# EAGLE design tri-led-blinker (EAGLE 7.3.0)
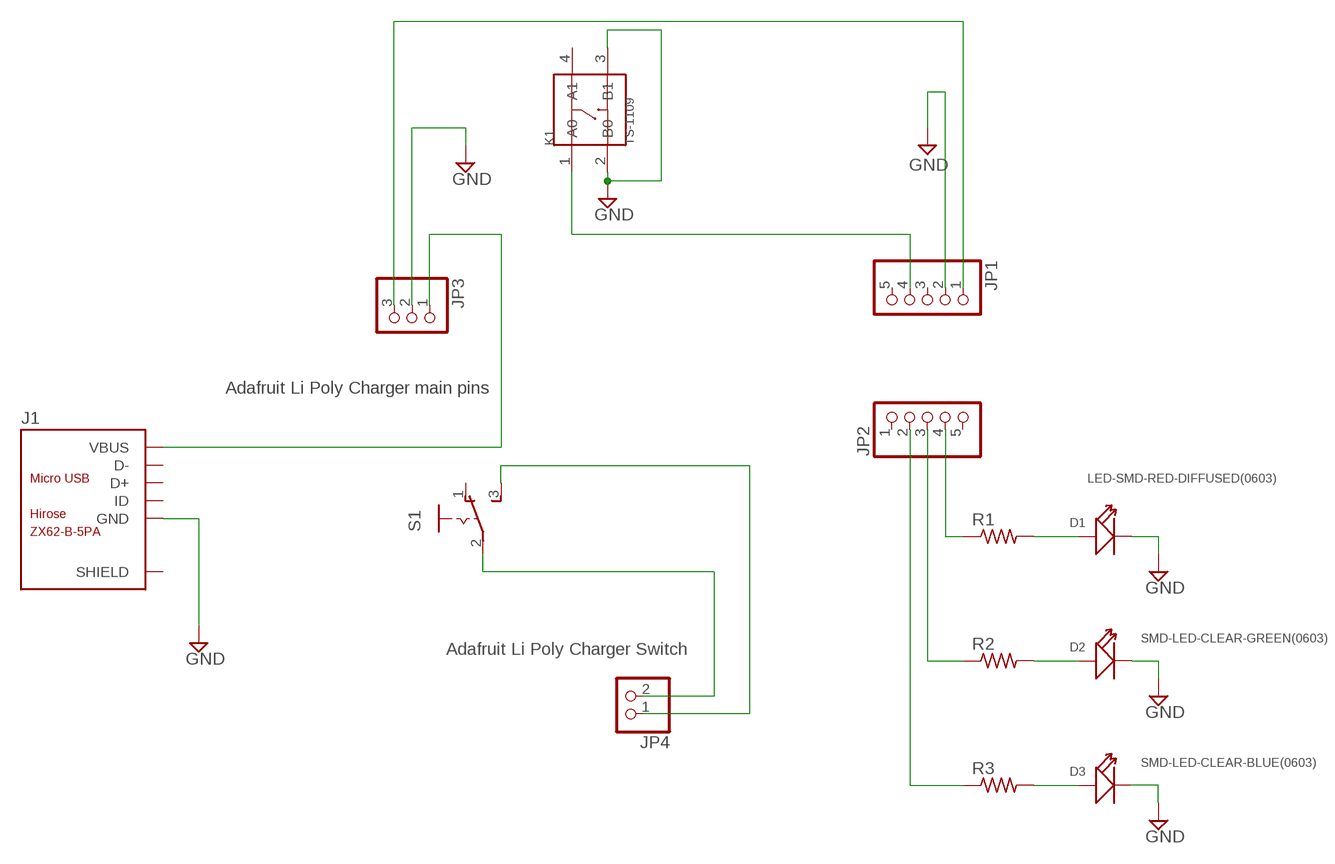
[diagram p0: schematic, sheet 1]

## Parts
D1  LED-SMD-RED-DIFFUSED(0603)  [LED-0603]
D2  SMD-LED-CLEAR-GREEN(0603)  [LED-0603]
D3  SMD-LED-CLEAR-BLUE(0603)  [LED-0603]
J1  MICRO-USB-SMD(ZX62-B-5PA)  [MICRO-USB5+6P-SMD-0.65-AB]
JP1  PINHD-1X5  [1X05]
JP2  PINHD-1X5  [1X05]
JP3  Adafruit Li Poly Charger main pins  PINHD-1X3  [1X03]
JP4  Adafruit Li Poly Charger Switch  PINHD-1X2  [1X02]
K1  TS-1109  DIP-BUTTON-4P  [SW4-6.0X6.0X5.0MM]
R1  R-US_0207/7  [0207/7]
R2  R-US_0207/7  [0207/7]
R3  R-US_0207/7  [0207/7]
S1  M251  [M251]

## Nets
GND: D1.- D2.- D3.- J1.5(GND) JP1.2 JP3.2 K1.2(B0) K1.3(B1)
N$1: D1.+ R1.2
N$2: JP4.2 S1.2(P)
N$3: JP4.1 S1.3(S)
N$4: D2.+ R2.2
N$5: JP1.4 K1.1(A0)
N$6: JP2.2 R3.1
N$7: D3.+ R3.2
N$8: JP2.4 R1.1
N$9: JP1.1 JP3.3
N$10: JP2.3 R2.1
VBUS: J1.1(VBUS) JP3.1
Unconnected: J1.2(D-) J1.3(D+) J1.4(ID) J1.P1(SHIELD) J1.P2(SHIELD) J1.P3(SHIELD) J1.P4(SHIELD) J1.P5(SHIELD) J1.P6(SHIELD) JP1.3 JP1.5 JP2.1 JP2.5 K1.4(A1) S1.1(O)

## Library data of the parts
D1 = Seeed-OPL-Diode:LED-SMD-RED-DIFFUSED(0603): 304090042; MPN: 19-217-R6C-AL1M2VY-3T
D2 = Seeed-OPL-Diode:SMD-LED-CLEAR-GREEN(0603): 304090043; MPN: 19-217-G7C-AN1P2-3T
D3 = Seeed-OPL-Diode:SMD-LED-CLEAR-BLUE(0603): 304090045; MPN: 19-217-BHC-ZL1M2RY-3T
J1 = Seeed-OPL-Connector:MICRO-USB-SMD(ZX62-B-5PA): 320010005
JP1 JP2 = pinhead:PINHD-1X5: PIN HEADER
JP3 = pinhead:PINHD-1X3: PIN HEADER
JP4 = pinhead:PINHD-1X2: PIN HEADER
K1 = Seeed-OPL-Button:DIP-BUTTON-4P: 311020024
R1-R3 = resistor:R-US_: RESISTOR, American symbol
S1 = switch:M251: SLIDING SWITCH Mors, distributor Buerklin, 11G702

## Board
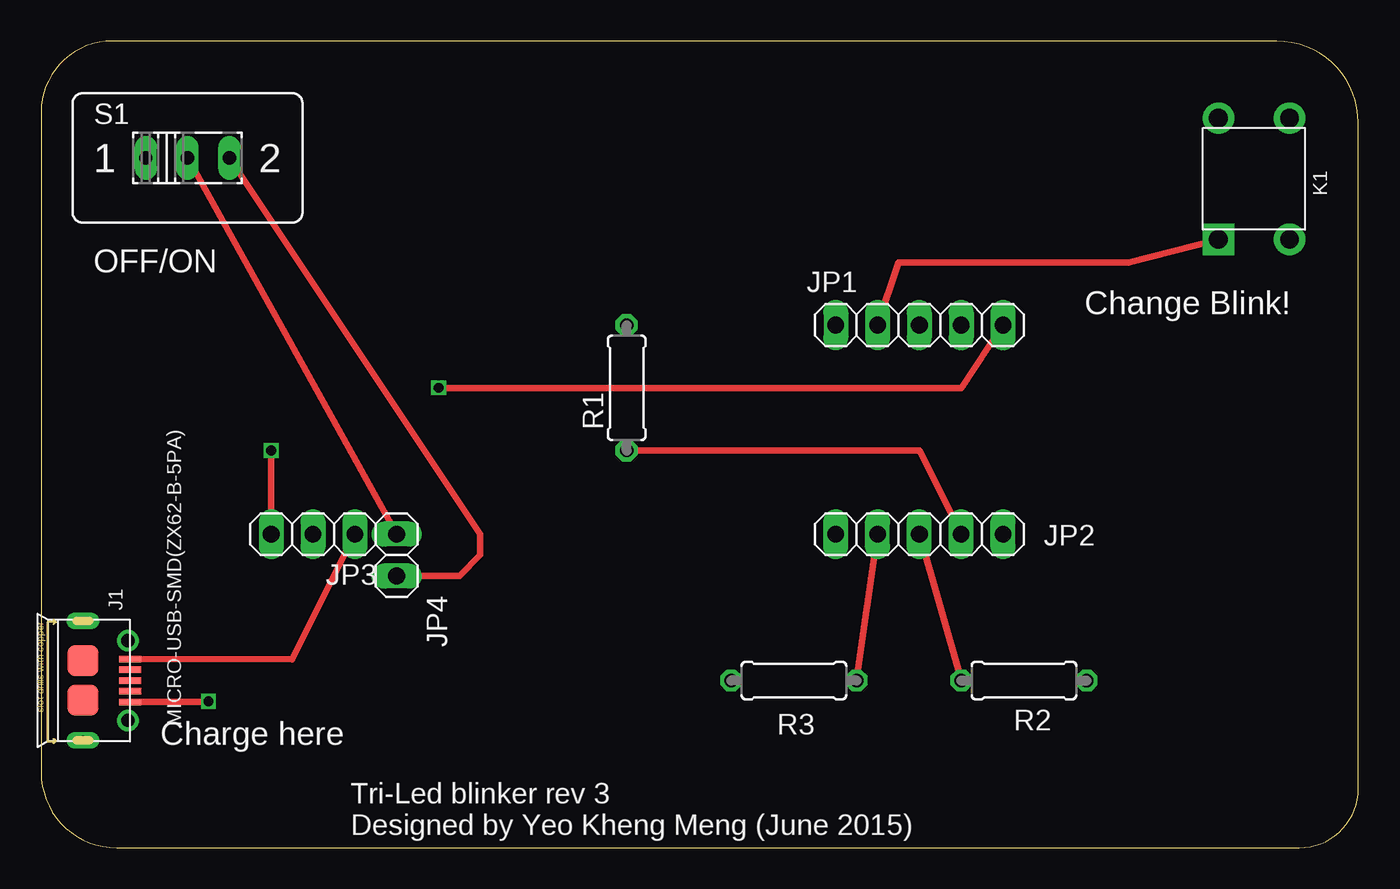
[diagram p1: board, top side]
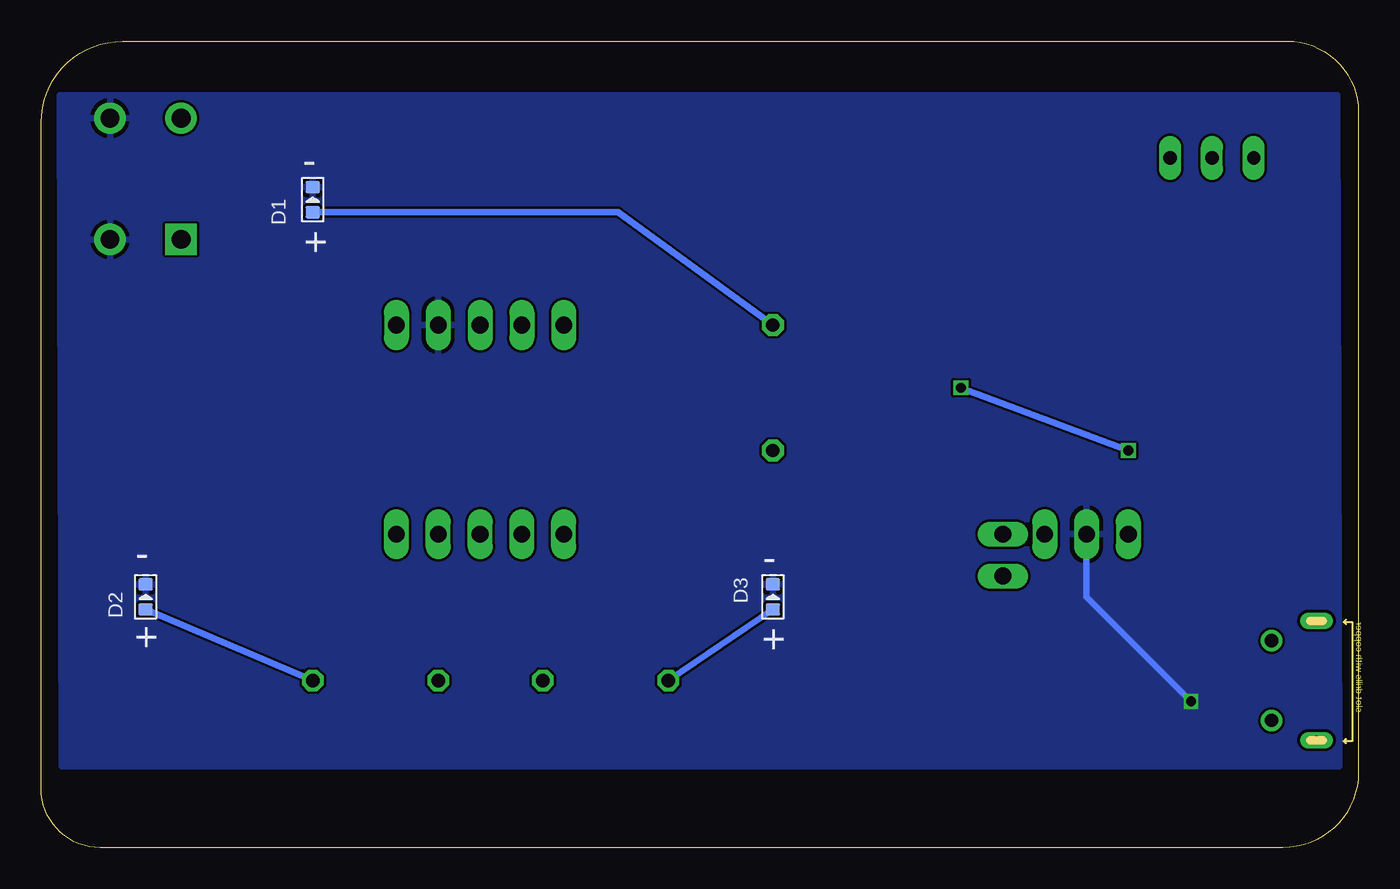
[diagram p2: board, bottom side, seen from below]

Size 80 x 49 mm. Coordinates in mm from the lower left corner, seen from the top.
Outline: 80,3.58 80,44.06 arc90 75.06,49 4.31,49 arc90 0,44.69 0,4.58 arc90 4.58,0 76.42,0 arc90 80,3.58
Copper layers (1*16): Top 0.035mm / dielectric 1.5mm / Bottom 0.035mm
Design rules "SeeedStudio_2layer_DRU_no_angle_20140221": minimum track width 6mil, minimum drill 12mil, track to track 6mil, track to pad 6mil, pad to pad 6mil, via to via 6mil, smd to smd 0mil, copper to edge 10mil, drill to drill 10mil, minimum pad ring 10mil, minimum via ring 6mil, stop-mask expansion 2mil, vias tented up to drill 100mil, thermal gap 10mil

### Footprints (pad centres in the part's own frame; a part is rotated, then mirrored left to right if it is on the bottom)
LED-0603 = smd 0.762 x 0.889: + -0.762,0; - 0.762,0
MICRO-USB5+6P-SMD-0.65-AB = smd 0.4 x 1.35: 1 -1.3,2.875; 2 -0.65,2.875; 3 0,2.875; 4 0.65,2.875; 5 1.3,2.875 | smd 1.9 x 1.9: P1 -1.2,0; P2 1.2,0 | drill 0.508 pad 1.016 long: P3 -3.625,0; P4 3.625,0 | drill 0.8: P5 -2.425,2.73; P6 2.425,2.73
1X05 = drill 1.016 long: 1 -5.08,0; 2 -2.54,0; 3 0,0; 4 2.54,0; 5 5.08,0
1X03 = drill 1.016 long: 1 -2.54,0; 2 0,0; 3 2.54,0
1X02 = drill 1.016 long: 1 -1.27,0; 2 1.27,0
SW4-6.0X6.0X5.0MM = drill 1.143 pad 1.905 square: 1 -3.683,2.159 | drill 1.143 pad 1.905: 2 -3.683,-2.159; 3 3.683,-2.159; 4 3.683,2.159
0207/7 = drill 0.813 octagon: 1 -3.81,0; 2 3.81,0
M251 = drill 0.813 long: 1 -2.54,0; 2 0,0; 3 2.54,0

### Placement (x,y rotation side)
D1  63.5,39.37 90 bottom
D2  73.66,15.24 90 bottom
D3  35.56,15.24 90 bottom
J1  2.54,10.16 270 top
JP1  53.34,31.75 180 top
JP2  53.34,19.05 0 top
JP3  16.51,19.05 180 top
JP4  21.59,17.78 90 top
K1  73.66,40.64 90 top
R1  35.56,27.94 90 top
R2  59.69,10.16 0 top
R3  45.72,10.16 180 top
S1  8.89,41.91 0 top

### Tracks (layer width: path | path; a pad name or v marks a point on that pad's centre or on a via)
GND  (via drill 0.6)
  Top 0.406: J1.5 10.16,8.86 v10.16,8.89
  Bottom 0.406: v10.16,8.89 16.51,15.24 JP3.2
  pour Bottom: 1.27,45.72 78.87,45.72 78.74,4.95 1.14,4.95
N$1
  Bottom 0.406: R1.2 44.96,38.61 D1.+
N$2
  Top 0.406: JP4.2 S1.2
N$3
  Top 0.406: JP4.1 25.4,16.51 26.67,17.78 26.67,19.05 S1.3
N$4
  Bottom 0.406: R2.2 D2.+
N$5
  Top 0.406: K1.1 66.04,35.56 52.07,35.56 JP1.4
N$6
  Top 0.406: JP2.2 R3.1
N$7
  Bottom 0.406: R3.2 D3.+
N$8
  Top 0.406: JP2.4 53.34,24.13 R1.1
N$9  (via drill 0.6)
  Top 0.406: v24.13,27.94 55.88,27.94 JP1.1 | JP3.3 v13.97,24.13
  Bottom 0.406: v13.97,24.13 v24.13,27.94
N$10
  Top 0.406: JP2.3 R2.1
VBUS
  Top 0.406: J1.1 15.24,11.43 JP3.1

### Text on the board
tPlace: OFF/ON | Change Blink! | Charge here | Tri-Led blinker rev 3 / Designed by Yeo Kheng Meng (June 2015)
bPlace: - | + | - | - | + | +